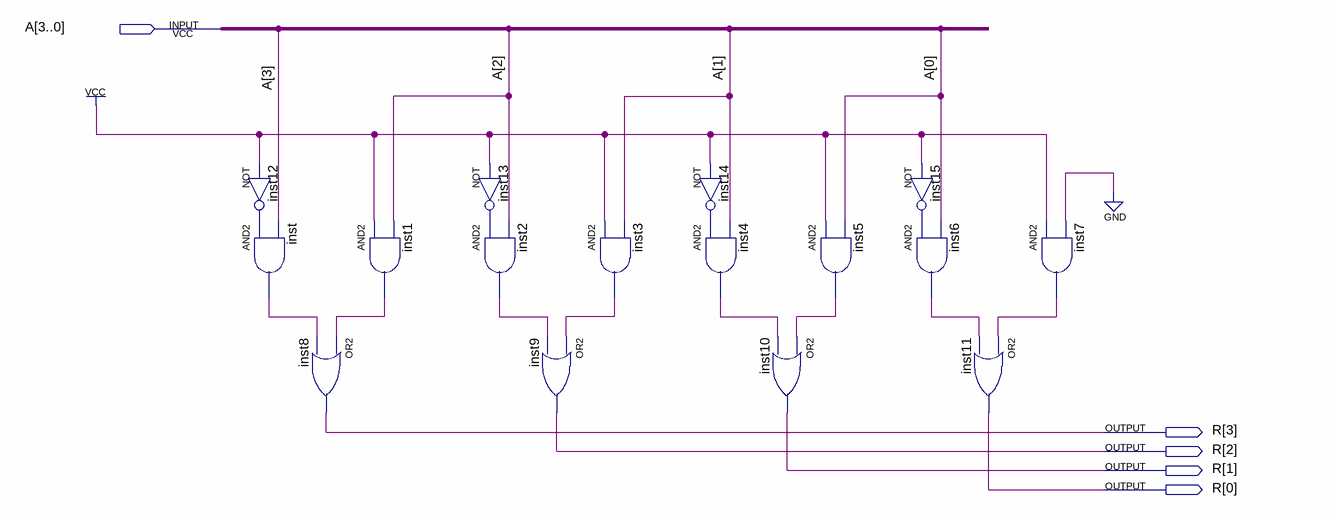
[diagram p0: schematic sheet]
// Quartus schematic shiftleft.bdf as structural Verilog: 16 symbols, 5 pins
module shiftleft (
  input  [3:0] A,
  output [3:0] R
);

  wire inst1_out, inst2_out, inst3_out, inst4_out, inst5_out, inst6_out, inst7_out, inst12_out, inst13_out,
       inst14_out, inst15_out, inst_out;

  not inst12 (inst12_out, 1'b1);
  and inst (inst_out, inst12_out, A[3]);
  and inst1 (inst1_out, 1'b1, A[2]);
  or inst8 (R[3], inst1_out, inst_out);
  not inst13 (inst13_out, 1'b1);
  and inst2 (inst2_out, inst13_out, A[2]);
  and inst3 (inst3_out, 1'b1, A[1]);
  or inst9 (R[2], inst3_out, inst2_out);
  not inst14 (inst14_out, 1'b1);
  and inst4 (inst4_out, inst14_out, A[1]);
  and inst5 (inst5_out, 1'b1, A[0]);
  or inst10 (R[1], inst5_out, inst4_out);
  not inst15 (inst15_out, 1'b1);
  and inst6 (inst6_out, inst15_out, A[0]);
  or inst11 (R[0], inst7_out, inst6_out);
  and inst7 (inst7_out, 1'b1, 1'b0);
endmodule
